# Altium project zhernakov_pwron_circuit.PrjPcb
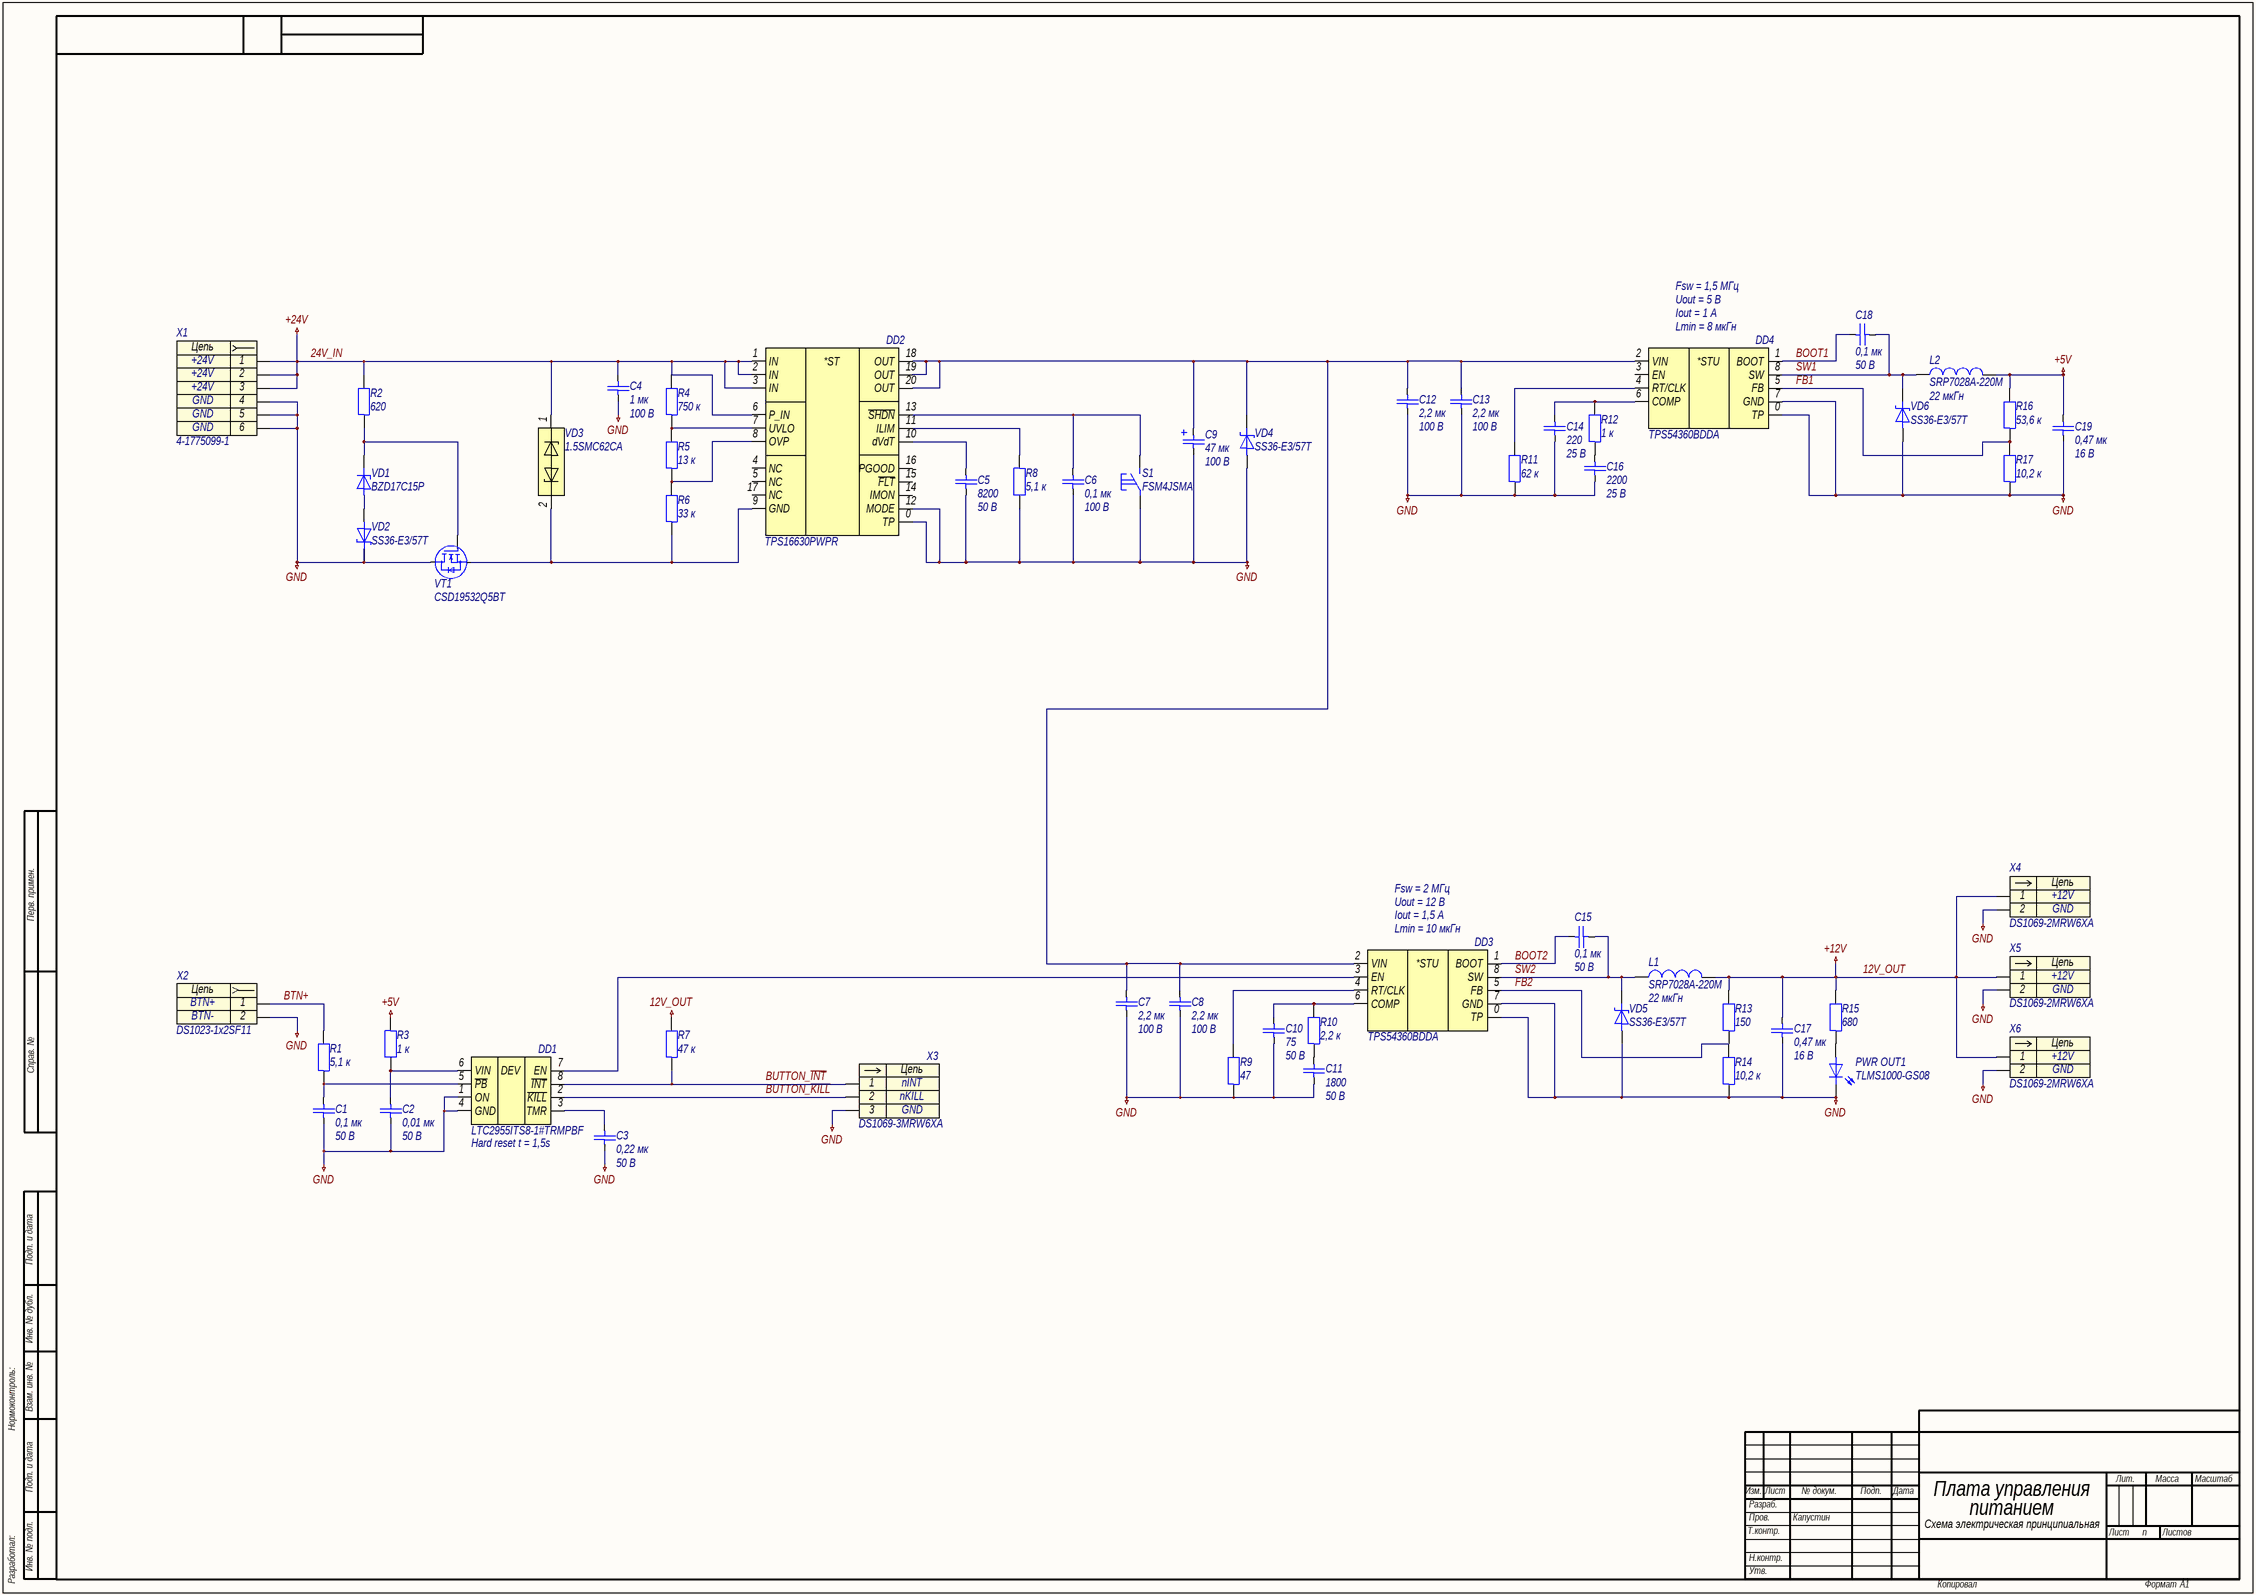
[diagram p0: zhernakov_pwron_circuit.SchDoc]
approver: Капустин; check: Капустин; designation: СПБПУ.3331506.005; developer: Жернаков; document_code: Ý3; document_type: Схема электрическая принципиальная; pcb_dec_number: СПБПУ.3331506.005; project: Плата управления питанием; sheets_total: M; title: Плата управления питанием; title_line_1: Плата управления; title_line_2: питанием
1 sheet, 57 parts. Net scope: global (net labels, ports and power ports of the same name join across sheets).
Board file: zhernakov_pwron_circuit.PcbDoc

## Sheet zhernakov_pwron_circuit.SchDoc: Плата управления питанием
size 840 x 594 mm; ApprovedBy: Капустин; CheckedBy: Капустин; DrawnBy: Жернаков; DocumentNumber: СПБПУ.3331506.005Ý3; SheetNumber: n; SheetTotal: M; DocumentCode: Ý3; ImagePath: СПБПУ.3331506.005

### Parts
C1  0,1 мк  Напряжение: 50 В  [C0603]
C2  0,01 мк  Напряжение: 50 В  [C0603]
C3  0,22 мк  Напряжение: 50 В  [C0603]
C4  1 мк  Напряжение: 100 В  [C1206]
C5  8200  Напряжение: 50 В  [C0402]
C6  0,1 мк  Напряжение: 100 В  [C0603]
C7  2,2 мк  Напряжение: 100 В  [C1206]
C8  2,2 мк  Напряжение: 100 В  [C1206]
C9  47 мк  Напряжение: 100 В  [CAPAE-1000X1000X1200]
C10  75  Напряжение: 50 В  [C0402]
C11  1800  Напряжение: 50 В  [C0402]
C12  2,2 мк  Напряжение: 100 В  [C1206]
C13  2,2 мк  Напряжение: 100 В  [C1206]
C14  220  Напряжение: 25 В  [C0603]
C15  0,1 мк  Напряжение: 50 В  [C0603]
C16  2200  Напряжение: 25 В  [C0201]
C17  0,47 мк  Напряжение: 16 В  [C0603]
C18  0,1 мк  Напряжение: 50 В  [C0603]
C19  0,47 мк  Напряжение: 16 В  [C0603]
DD1  LTC2955ITS8-1#TRMPBF  [SOT-23-8-P65-290X280X100]
DD2  TPS16630PWPR  [HTSSOP-20-P65-650X440X120-L63X25-T296X296]
DD3  TPS54360BDDA  [HSOIC-8-P127-490X390X170-L84X41-T310X240]
DD4  TPS54360BDDA  [HSOIC-8-P127-490X390X170-L84X41-T310X240]
L1  SRP7028A-220M  Индуктивность: 22 мкГн  [SRP-2-730X660X280]
L2  SRP7028A-220M  Индуктивность: 22 мкГн  [SRP-2-730X660X280]
PWR_OUT1  TLMS1000-GS08  [HL0603]
R1  5,1 к  [R0603]
R2  620  [R0603]
R3  1 к  [R0603]
R4  750 к  [R0603]
R5  13 к  [R0603]
R6  33 к  [R0603]
R7  47 к  [R0603]
R8  5,1 к  [R0603]
R9  47  [R0603]
R10  2,2 к  [R0603]
R11  62 к  [R0603]
R12  1 к  [R0603]
R13  150  [R0603]
R14  10,2 к  [R0603]
R15  680  [R0603]
R16  53,6 к  [R0603]
R17  10,2 к  [R0603]
S1  FSM4JSMA  [FSM4JSMA]
VD1  BZD17C15P  [DO-219AB-280X180X108]
VD2  SS36-E3/57T  [DO-214AB-790X590X262]
VD3  1.5SMC62CA  [DO-214AB-790X590X262]
VD4  SS36-E3/57T  [DO-214AB-790X590X262]
VD5  SS36-E3/57T  [DO-214AB-790X590X262]
VD6  SS36-E3/57T  [DO-214AB-790X590X262]
VT1  CSD19532Q5BT  [VSONP-8-P127-600X500X105]
X1  4-1775099-1  [4-1775099-1]
X2  DS1023-1x2SF11  [DS1023-1X2SF11]
X3  DS1069-3MRW6XA  [DS1069-3MRW6XA]
X4  DS1069-2MRW6XA  [DS1069-2MRW6XA]
X5  DS1069-2MRW6XA  [DS1069-2MRW6XA]
X6  DS1069-2MRW6XA  [DS1069-2MRW6XA]

### Nets
12V_OUT: C17.1 L1.2 R7.2 R13.2 R15.2 X4.1 X5.1 X6.1  [also labelled +12V]
24V_IN: C4.1 DD2.1(IN) DD2.2(IN) DD2.3(IN) DD2.6(P_IN) R2.2 R4.2 VD3.1 X1.1 X1.2 X1.3  [also labelled +24V]
+5V: C19.1 L2.2 R3.1 R16.2
GND: C1.2 C2.2 C3.2 C4.2 C5.2 C6.2 C7.2 C8.2 C9.2 C10.2 C11.2 C12.2 C13.2 C14.2 C16.2 C17.2 C19.2 DD1.1(ON) DD1.4(GND) DD2.0(TP) DD2.12(MODE) DD3.0(TP) DD3.7(GND) DD4.0(TP) DD4.7(GND) PWR_OUT1.1 R8.2 R9.1 R11.1 R14.1 R17.1 S1.1 VD2.1 VD4.2 VD5.2 VD6.2 VT1.D X1.4 X1.5 X1.6 X2.2 X3.3 X4.2 X5.2 X6.2
BOOT1: C18.1 DD4.1(BOOT)
BOOT2: C15.1 DD3.1(BOOT)
BTN+: R1.2 X2.1
BUTTON_~{INT}: DD1.8(~{INT}) R7.1 X3.1
BUTTON_~{KILL}: DD1.2(~{KILL}) X3.2
FB1: DD4.5(FB) R16.1 R17.2
FB2: DD3.5(FB) R13.1 R14.2
SW1: C18.2 DD4.8(SW) L2.1 VD6.1
SW2: C15.2 DD3.8(SW) L1.1 VD5.1
NetC1_1: C1.1 DD1.5(~{PB}) R1.1
NetC2_1: C2.1 DD1.6(VIN) R3.2
NetC3_1: C3.1 DD1.3(TMR)
NetC5_1: C5.1 DD2.10(dVdT)
NetC6_1: C6.1 DD2.13(~{SHDN}) S1.2
NetC7_1: C7.1 C8.1 C9.1 C12.1 C13.1 DD2.18(OUT) DD2.19(OUT) DD2.20(OUT) DD3.2(VIN) DD4.2(VIN) VD4.1
NetC10_1: C10.1 DD3.6(COMP) R10.2
NetC11_1: C11.1 R10.1
NetC14_1: C14.1 DD4.6(COMP) R12.2
NetC16_1: C16.1 R12.1
NetDD1_7: DD1.7(EN) DD3.3(EN)
NetDD2_7: DD2.7(UVLO) R4.1 R5.2
NetDD2_8: DD2.8(OVP) R5.1 R6.2
NetDD2_9: DD2.9(GND) R6.1 VD3.2 VT1.S
NetDD2_11: DD2.11(ILIM) R8.1
NetDD3_4: DD3.4(RT/CLK) R9.2
NetDD4_4: DD4.4(RT/CLK) R11.2
NetPWR_OUT1_2: PWR_OUT1.2 R15.1
NetR2_1: R2.1 VD1.1 VT1.G
NetVD1_2: VD1.2 VD2.2

Not connected (* = marked no-connect by the designer): DD2 4(NC) 5(NC) 14(IMON) 15(~{FLT}) 16(PGOOD) 17(NC); DD4 3(EN)

### Notes on the sheet
- Fsw = 1,5 МГц
- Uout = 5 В
- Iout = 1 А
- (near DD4) Lmin = 8 мкГн
- Fsw = 2 МГц
- Uout = 12 В
- Iout = 1,5 А
- (near DD3) Lmin = 10 мкГн
- Hard reset t = 1,5s
- Перв. примен.
- Справ. №
- Подп. и дата
- Инв. № дубл.
- Нормоконтроль:
- Взам. инв. №
- Изм.
- Лист
- № докум.
- Подп.
- Дата
- Лит.
- Масса
- Масштаб
- Т.контр.
- Пров.
- Разраб.
- Листов
- Разработал:
- Инв. № подл.
- Н.контр.
- Утв.
- Копировал
- Формат
- А1
- (in symbol dd0007) *STU; *ST
- (in symbol dd0008) DEV
- (in symbol x0007) Цепь
- (in symbol x0032) Цепь
- (in symbol x0040) Цепь
- (in symbol x0042) Цепь

### Library data of the parts
C1 C15 C18 = c0088: =Описание; ID: c0088; Фамилия: Паньков; Описание: Конденсатор керамический чип 0603 100 нФ 50 В ±10 %; Наименование: CC0603KRX7R9BB104; Производитель: YAGEO Corp.; Отклонение: ±10 %; Рабочие температуры: от –55 °С до +125 °С; Температурный коэффициент емкости: X7R; Корпус: 0603; Номинал: 0,1 мк; Номинальное напряжение: 50 В; HelpURL: https://www.yageo.com/upload/media/product/productsearch/datasheet/mlcc/UPY-GPHC_X7R_6.3V-to-50V_20.pdf
C2 = c0058: =Описание; ID: c0058; Фамилия: Паньков; Описание: Конденсатор керамический чип 0603 10 нФ 50 В ±10 %; Наименование: CC0603KRX7R9BB103; Производитель: YAGEO Corp.; Отклонение: ±10 %; Рабочие температуры: от –55 °С до +125 °С; Температурный коэффициент емкости: X7R; Корпус: 0603; Номинал: 0,01 мк; Номинальное напряжение: 50 В; HelpURL: https://www.yageo.com/upload/media/product/productsearch/datasheet/mlcc/UPY-GPHC_X7R_6.3V-to-50V_20.pdf
C3 = c0098: =Описание; ID: c0098; Фамилия: Паньков; Описание: Конденсатор керамический чип 0603 220 нФ 50 В ±10 %; Наименование: CC0603KRX5R9BB224; Производитель: YAGEO Corp.; Отклонение: ±10 %; Рабочие температуры: от –55 °С до +85 °С; Температурный коэффициент емкости: X5R; Корпус: 0603; Номинал: 0,22 мк; Номинальное напряжение: 50 В; HelpURL: https://www.yageo.com/upload/media/product/productsearch/datasheet/mlcc/UPY-GPHC_X5R_4V-to-50V_26.pdf
C4 = c0120: =Описание; ID: c0120; Фамилия: Ларионов; Описание: Конденсатор керамический чип 1206 1 мкФ 100 В ±10 %; Наименование: CC1206KKX7R0BB105; Производитель: YAGEO Corp.; Отклонение: ±10 %; Рабочие температуры: от –55 °С до +125 °С; Температурный коэффициент емкости: X7R; Корпус: 1206; Номинал: 1 мк; Номинальное напряжение: 100 В; HelpURL: https://www.yageo.com/upload/media/product/productsearch/datasheet/mlcc/UPY-NP0X7R_MV_100-to-630V_22.pdf
C5 = c0009: =Описание; ID: c0009; Фамилия: Жернаков; Описание: Конденсатор керамический чип 0402 8,2 нФ 50 В ±10 %; Наименование: CL05B822KB5NNNC; Производитель: Samsung Electro-Mechanics; Отклонение: ±10 %; Рабочие температуры: от –55 °С до +125 °С; Температурный коэффициент емкости: X7R; Корпус: 0402; Номинал: 8200; Номинальное напряжение: 50 В; HelpURL: http://product.samsungsem.com/mlcc/CL05B822KB5NNN.do
C6 = c0089: =Описание; ID: c0089; Фамилия: Ларионов; Описание: Конденсатор керамический чип 0603 100 нФ 100 В ±10 %; Наименование: CC0603KRX7R0BB104; Производитель: YAGEO Corp.; Отклонение: ±10 %; Рабочие температуры: от –55 °С до +125 °С; Температурный коэффициент емкости: X7R; Корпус: 0603; Номинал: 0,1 мк; Номинальное напряжение: 100 В; HelpURL: https://www.yageo.com/upload/media/product/productsearch/datasheet/mlcc/UPY-NP0X7R_MV_100-to-630V_22.pdf
C7 C8 C12 C13 = c0131: =Описание; ID: c0131; Фамилия: Ларионов; Описание: Конденсатор керамический чип 1206 2,2 мкФ 100 В ±10 %; Наименование: CC1206KKX7R0BB225; Производитель: YAGEO Corp.; Отклонение: ±10 %; Рабочие температуры: от –55 °С до +125 °С; Температурный коэффициент емкости: X7R; Корпус: 1206; Номинал: 2,2 мк; Номинальное напряжение: 100 В; HelpURL: https://www.yageo.com/upload/media/product/productsearch/datasheet/mlcc/UPY-NP0X7R_MV_100-to-630V_22.pdf
C9 = c0165: =Описание; ID: c0165; Фамилия: Ларионов; Описание: Конденсатор электролитический алюминиевый 47 мкФ 100 В ±20 %; Наименование: MAL214699904E3; Производитель: Vishay Intertechnology, Inc.; Отклонение: ±20 %; Эквивалентное последовательное сопротивление: 4,1 Ом; Среднеквадратичный размах пульсации тока: 0,23 А; Рабочие температуры: от –55 °С до +125 °С; Корпус: CAPAE (10 x 10 x 12); Номинал: 47 мк; Номинальное напряжение: 100 В; HelpURL: https://www.vishay.com/capacitors/list/product-28403/
C10 = c0004: =Описание; ID: c0004; Фамилия: Жернаков; Описание: Конденсатор керамический чип 0402 75 пФ 50 В ±5 %; Наименование: CL05C750JB5NNNC; Производитель: Samsung Electro-Mechanics; Отклонение: ±5 %; Рабочие температуры: от –55 °С до +125 °С; Температурный коэффициент емкости: C0G; Корпус: 0402; Номинал: 75; Номинальное напряжение: 50 В; HelpURL: http://product.samsungsem.com/mlcc/CL05C750JB5NNN.do
C11 = c0007: =Описание; ID: c0007; Фамилия: Жернаков; Описание: Конденсатор керамический чип 0201 1,8 нФ 50 В ±10 %; Наименование: CL05B182KB5NNWC; Производитель: Samsung Electro-Mechanics; Отклонение: ±10 %; Рабочие температуры: от –55 °С до +125 °С; Температурный коэффициент емкости: X7R; Корпус: 0402; Номинал: 1800; Номинальное напряжение: 50 В; HelpURL: http://product.samsungsem.com/mlcc/CL05B182KB5NNW.do
C14 = c0029: =Описание; ID: c0029; Фамилия: Паньков; Описание: Конденсатор керамический чип 0603 220 пФ 25 В ±1 %; Наименование: CC0603FRNPO8BN221; Производитель: YAGEO Corp.; Отклонение: ±1 %; Рабочие температуры: от –55 °С до +125 °С; Температурный коэффициент емкости: C0G; Корпус: 0603; Номинал: 220; Номинальное напряжение: 25 В; HelpURL: https://www.yageo.com/upload/media/product/productsearch/datasheet/mlcc/UPY-GP_NP0_16V-to-50V_18.pdf
C16 = c0044: =Описание; ID: c0044; Фамилия: Паньков; Описание: Конденсатор керамический чип 0201 2,2 нФ 25 В ±10 %; Наименование: CC0201KRX5R8BB222; Производитель: YAGEO Corp.; Отклонение: ±10 %; Рабочие температуры: от –55 °С до +85 °С; Температурный коэффициент емкости: X5R; Корпус: 0201; Номинал: 2200; Номинальное напряжение: 25 В; HelpURL: https://www.yageo.com/upload/media/product/productsearch/datasheet/mlcc/UPY-GPHC_X5R_4V-to-50V_26.pdf
C17 C19 = c0104: =Описание; ID: c0104; Фамилия: Паньков; Описание: Конденсатор керамический чип 0603 470 нФ 16 В ±10 %; Наименование: CC0603KRX5R7BB474; Производитель: YAGEO Corp.; Отклонение: ±10 %; Рабочие температуры: от –55 °С до +85 °С; Температурный коэффициент емкости: X5R; Корпус: 0603; Номинал: 0,47 мк; Номинальное напряжение: 16 В; HelpURL: https://www.yageo.com/upload/media/product/productsearch/datasheet/mlcc/UPY-GPHC_X5R_4V-to-50V_26.pdf
DD1 = dd0008: =Описание; ID: dd0008; Фамилия: Жернаков; Описание: Контроллер включения/выключения; Производитель: Analog Devices, Inc.; Напряжение: от 1,5 В до 36 В; Максимальное напряжение: 36 В; Ток: —; Рабочие температуры: от –40 °С до +85 °С; Корпус: SOT-23-8; Наименование: LTC2955ITS8-1#TRMPBF; HelpURL: https://www.analog.com/en/products/ltc2955.html
DD2 = dd0007: =Описание; ID: dd0007; Фамилия: Жернаков; Описание: Защитная микросхема eFuse 60 В и 6 А; Производитель: Texas Instruments Inc.; Напряжение: от 4,5 В до 60 В; Максимальное напряжение: 67 В; Ток: от 0,6 А до 6 А; Рабочие температуры: от –40 °С до +125 °С; Корпус: HTSSOP-20; Наименование: TPS16630PWPR; HelpURL: https://www.ti.com/product/TPS1663
DD3 DD4 = dd0007: =Описание; ID: dd0007; Фамилия: Жернаков; Описание: Понижающий преобразователь напряжения 4,5…60 В / 1…58,8 В и 3,5 А; Производитель: Texas Instruments Inc.; Входное напряжение: от 4,5 В до 60 В; Выходное напряжение: от 1,0 В до 58,8 В; Коммутируемый ток: до 3,5 А; Частота переключения: от 100 кГц до 2,5 МГц; Рабочие температуры: от –40 °С до +150 °С; Корпус: HSOIC-8; Наименование: TPS54360BDDA; HelpURL: https://www.ti.com/product/TPS54360B
L1 L2 = l0013: =Описание; ID: l0013; Фамилия: Ларионов; Описание: Катушка индуктивности 22 мкГн ±20 %; Производитель: Bourns, Inc.; Отклонение: ±20 %; Номинальное активное сопротивление: 165 мОм; Максимальное активное сопротивление: 190 мОм; Резонансная частота: 10 МГц; Номинальный ток (при нагреве на 20 °С/40 °С): 2 А; Ток насыщения: 3,5 А; Рабочее напряжение: не указано; Рабочие температуры: от –55 °С до +150 °С; Корпус: 7,3 x 6,6 x 2,8; Наименование: SRP7028A-220M; Номинал: 22 мкГн; HelpURL: https://www.bourns.com/products/magnetic-products/power-inductors-aec-q200-compliant/product/SRP7028A
PWR_OUT1 = hl0001: =Описание; ID: hl0001; Фамилия: Ларионов; Описание: Светодиод чип 0603 красный; Производитель: Vishay Intertechnology, Inc.; Цвет: Red; Номинальная сила света: 4 мкд; Номинальная длина волны: 628 нм; Номинальный прямой ток: 15 мА; Номинальное падение напряжения: 1,8 В; Рассеиваемая мощность: 40 мВт; Рабочие температуры: от -40 °С до +100 °С; Корпус: 0603; Наименование: TLMS1000-GS08; HelpURL: https://www.vishay.com/leds/list/product-83172/
R1 = r0096: =Описание; ID: r0096; Фамилия: Жернаков; Описание: Резистор чип 0603 5,1 кОм ±1 % 0,1 Вт; Наименование: RC0603FR-075K1L; Производитель: YAGEO Corp.; Отклонение: ±1 %; Номинальное напряжение: 75 В; Номинальный ток: 1 А; Рабочие температуры: от –55 °С до +155 °С; Корпус: 0603; Примечание: Ряд E24; Номинал: 5,1 к; HelpURL: https://www.yageo.com/upload/media/product/productsearch/datasheet/rchip/PYu-RC_Group_51_RoHS_L_11.pdf
R2 = r0071: =Описание; ID: r0071; Фамилия: Паньков; Описание: Резистор чип 0603 620 Ом ±1 % 0,1 Вт; Наименование: RC0603FR-07620RL; Производитель: YAGEO Corp.; Отклонение: ±1 %; Номинальное напряжение: 75 В; Номинальный ток: 1 А; Рабочие температуры: от –55 °С до +155 °С; Корпус: 0603; Примечание: Ряд E24; Номинал: 620; HelpURL: https://www.yageo.com/upload/media/product/productsearch/datasheet/rchip/PYu-RC_Group_51_RoHS_L_11.pdf
R3 R12 = r0076: =Описание; ID: r0076; Фамилия: Ларионов; Описание: Резистор чип 0603 1 кОм ±1 % 0,1 Вт; Наименование: RC0603FR-071KL; Производитель: YAGEO Corp.; Отклонение: ±1 %; Номинальное напряжение: 75 В; Номинальный ток: 1 А; Рабочие температуры: от –55 °С до +155 °С; Корпус: 0603; Примечание: Ряд E24; Номинал: 1 к; HelpURL: https://www.yageo.com/upload/media/product/productsearch/datasheet/rchip/PYu-RC_Group_51_RoHS_L_11.pdf
R4 = r0170: =Описание; ID: r0170; Фамилия: Паньков; Описание: Резистор чип 0603 750 кОм ±1 % 0,1 Вт; Наименование: RC0603FR-07750KL; Производитель: YAGEO Corp.; Отклонение: ±1 %; Номинальное напряжение: 75 В; Номинальный ток: 1 А; Рабочие температуры: от –55 °С до +155 °С; Корпус: 0603; Примечание: Ряд E24; Номинал: 750 к; HelpURL: https://www.yageo.com/upload/media/product/productsearch/datasheet/rchip/PYu-RC_Group_51_RoHS_L_11.pdf
R5 = r0110: =Описание; ID: r0110; Фамилия: Жернаков; Описание: Резистор чип 0603 13 кОм ±1 % 0,1 Вт; Наименование: RC0603FR-0713KL; Производитель: YAGEO Corp.; Отклонение: ±1 %; Номинальное напряжение: 75 В; Номинальный ток: 1 А; Рабочие температуры: от –55 °С до +155 °С; Корпус: 0603; Примечание: Ряд E24; Номинал: 13 к; HelpURL: https://www.yageo.com/upload/media/product/productsearch/datasheet/rchip/PYu-RC_Group_51_RoHS_L_11.pdf
R6 = r0123: =Описание; ID: r0123; Фамилия: Паньков; Описание: Резистор чип 0603 33 кОм ±1 % 0,1 Вт; Наименование: RC0603FR-0733KL; Производитель: YAGEO Corp.; Отклонение: ±1 %; Номинальное напряжение: 75 В; Номинальный ток: 1 А; Рабочие температуры: от –55 °С до +155 °С; Корпус: 0603; Примечание: Ряд E24; Номинал: 33 к; HelpURL: https://www.yageo.com/upload/media/product/productsearch/datasheet/rchip/PYu-RC_Group_51_RoHS_L_11.pdf
R7 = r0129: =Описание; ID: r0129; Фамилия: Паньков; Описание: Резистор чип 0603 47 кОм ±1 % 0,1 Вт; Наименование: RC0603FR-0747KL; Производитель: YAGEO Corp.; Отклонение: ±1 %; Номинальное напряжение: 75 В; Номинальный ток: 1 А; Рабочие температуры: от –55 °С до +155 °С; Корпус: 0603; Примечание: Ряд E24; Номинал: 47 к; HelpURL: https://www.yageo.com/upload/media/product/productsearch/datasheet/rchip/PYu-RC_Group_51_RoHS_L_11.pdf
R8 = r0019: =Описание; ID: r0019; Фамилия: Жернаков; Описание: Резистор чип 0603 5,1 кОм ±1 % 0,1 Вт; Наименование: RC0603FR-075K1L; Производитель: YAGEO Corp.; Отклонение: ±1 %; Номинальное напряжение: 75 В; Рабочие температуры: от -55 °С до +155 °С; Номинальный ток: 1 А; Корпус: 0603; Номинал: 5,1 к; HelpURL: https://www.yageo.com/upload/media/product/productsearch/datasheet/rchip/PYu-RC_Group_51_RoHS_L_11.pdf
R9 = r0043: =Описание; ID: r0043; Фамилия: Паньков; Описание: Резистор чип 0603 47 Ом ±1 % 0,1 Вт; Наименование: RC0603FR-0747RL; Производитель: YAGEO Corp.; Отклонение: ±1 %; Номинальное напряжение: 75 В; Номинальный ток: 1 А; Рабочие температуры: от –55 °С до +155 °С; Корпус: 0603; Примечание: Ряд E24; Номинал: 47; HelpURL: https://www.yageo.com/upload/media/product/productsearch/datasheet/rchip/PYu-RC_Group_51_RoHS_L_11.pdf
R10 = r0085: =Описание; ID: r0085; Фамилия: Паньков; Описание: Резистор чип 0603 2,2 кОм ±1 % 0,1 Вт; Наименование: RC0603FR-072K2L; Производитель: YAGEO Corp.; Отклонение: ±1 %; Номинальное напряжение: 75 В; Номинальный ток: 1 А; Рабочие температуры: от –55 °С до +155 °С; Корпус: 0603; Примечание: Ряд E24; Номинал: 2,2 к; HelpURL: https://www.yageo.com/upload/media/product/productsearch/datasheet/rchip/PYu-RC_Group_51_RoHS_L_11.pdf
R11 = r0135: =Описание; ID: r0135; Фамилия: Паньков; Описание: Резистор чип 0603 62 кОм ±1 % 0,1 Вт; Наименование: RC0603FR-0762KL; Производитель: YAGEO Corp.; Отклонение: ±1 %; Номинальное напряжение: 75 В; Номинальный ток: 1 А; Рабочие температуры: от –55 °С до +155 °С; Корпус: 0603; Примечание: Ряд E24; Номинал: 62 к; HelpURL: https://www.yageo.com/upload/media/product/productsearch/datasheet/rchip/PYu-RC_Group_51_RoHS_L_11.pdf
R13 = r0056: =Описание; ID: r0056; Фамилия: Паньков; Описание: Резистор чип 0603 150 Ом ±1 % 0,1 Вт; Наименование: RC0603FR-07150RL; Производитель: YAGEO Corp.; Отклонение: ±1 %; Номинальное напряжение: 75 В; Номинальный ток: 1 А; Рабочие температуры: от –55 °С до +155 °С; Корпус: 0603; Примечание: Ряд E24; Номинал: 150; HelpURL: https://www.yageo.com/upload/media/product/productsearch/datasheet/rchip/PYu-RC_Group_51_RoHS_L_11.pdf
R14 R17 = r0014: =Описание; ID: r0014; Фамилия: Жернаков; Описание: Резистор чип 0603 10,2 кОм ±1 % 0,1 Вт; Наименование: RC0603FR-0710K2L; Производитель: YAGEO Corp.; Отклонение: ±1 %; Номинальное напряжение: 75 В; Рабочие температуры: от -55 °С до +155 °С; Номинальный ток: 1 А; Корпус: 0603; Номинал: 10,2 к; HelpURL: https://www.yageo.com/upload/media/product/productsearch/datasheet/rchip/PYu-RC_Group_51_RoHS_L_11.pdf
R15 = r0072: =Описание; ID: r0072; Фамилия: Паньков; Описание: Резистор чип 0603 680 Ом ±1 % 0,1 Вт; Наименование: RC0603FR-07680RL; Производитель: YAGEO Corp.; Отклонение: ±1 %; Номинальное напряжение: 75 В; Номинальный ток: 1 А; Рабочие температуры: от –55 °С до +155 °С; Корпус: 0603; Примечание: Ряд E24; Номинал: 680; HelpURL: https://www.yageo.com/upload/media/product/productsearch/datasheet/rchip/PYu-RC_Group_51_RoHS_L_11.pdf
R16 = r0017: =Описание; ID: r0017; Фамилия: Жернаков; Описание: Резистор чип 0603 53,6 кОм ±0,1 % 0,1 Вт; Наименование: RC0603BR-0753K6L; Производитель: YAGEO Corp.; Отклонение: ±0,1 %; Номинальное напряжение: 75 В; Рабочие температуры: от -55 °С до +155 °С; Номинальный ток: 1 А; Корпус: 0603; Номинал: 53,6 к; HelpURL: https://www.yageo.com/upload/media/product/productsearch/datasheet/rchip/PYu-RC_Group_51_RoHS_L_11.pdf
S1 = s0001: =Описание; ID: s0001; Фамилия: Паньков; Описание: Тактовая кнопка поверхностного монтажа; Производитель: TE Connectivity; Ток нагрузки: 50 мА @ 24 В; Сопротивление контакта: 100 мОм; Количество контактов: 4; Рабочие температуры: от –35 °С до +85 °С; Промывка: Запрещена; Корпус: 6,00 x 6,00 x 4,98; Наименование: FSM4JSMA; HelpURL: https://www.te.com/usa-en/product-4-1437565-1.html
VD1 = vd0016: =Описание; ID: vd0016; Фамилия: Жернаков; Описание: Стабилитрон 15 В; Производитель: Vishay Intertechnology, Inc.; Номинальное напряжение стабилизации: 15 В; Разброс напряжения стабилизации: 13,8...15,6 В; Номинальный ток стабилизации: 50 мА; Рабочие температуры: от –55 °С до +150 °С; Корпус: DO-219AB; Наименование: BZD17C15P; HelpURL: https://www.vishay.com/product?docid=85161
VD2 VD4-VD6 = vd0005: =Описание; ID: vd0005; Фамилия: Жернаков; Описание: Диод Шоттки 60 В 3 А; Производитель: Vishay Intertechnology, Inc.; Максимальное прямое напряжение: 0,75 В; Максимальное обратное напряжение: 60 В; Максимальный прямой ток: 3 А; Рабочие температуры: от –55 °С до +150 °С; Корпус: DO-214AB; Наименование: SS36-E3/57T; HelpURL: https://www.vishay.com/product?docid=88751
VD3 = vd0009: =Описание; ID: vd0009; Фамилия: Ларионов; Описание: Двунаправленная диодная сборка для подавления помех 53 В; Производитель: Littelfuse, Inc.; Корпус: DO-214AB; Наименование: 1.5SMC62CA; HelpURL: https://www.littelfuse.com/products/tvs-diodes/surface-mount/1_5smc.aspx
VT1 = vt0005: =Описание; ID: vt0005; Фамилия: Жернаков; Описание: Полевой N-канальный МДП-транзистор 100 В 17 А; Производитель: Texas Instruments Inc.; Напряжение затвор — исток: ±20 В; Напряжение сток — исток: 100 В; Ток стока: 17 А; Сопротивление сток — исток: 5,7 мОм; Рабочие температуры: от –55 °С до +150 °С; Корпус: SON-8; Наименование: CSD19532Q5BT; HelpURL: https://www.ti.com/product/CSD19532Q5B
X1 = x0007: =Описание; Contact_1: +24V; Contact_4: GND; ID: x0007; Фамилия: Жернаков; Описание: ATX Power 6 pin гнездо прямой; Производитель: TE Connectivity; Contact_2: +24V; Contact_3: +24V; Contact_5: GND; Contact_6: GND; Наименование: 4-1775099-1; HelpURL: https://www.te.com/usa-en/product-4-1775099-1.html
X2 = x0032: =Описание; Contact_1: BTN+; Contact_2: BTN-; ID: x0032; Фамилия: Паньков; Описание: PBS 2 pin 2,54 мм гнездо прямой; Производитель: Connfly Electronic Co., Ltd.; Наименование: DS1023-1x2SF11; HelpURL: http://en.connfly.group/product/xVkr=EusQssAN0gN=Aos=mU+UrVkR9kqEAN0gN0AUCUNB+A
X3 = x0042: =Описание; Contact_1: nINT; Contact_2: nKILL; Contact_3: GND; ID: x0042; Фамилия: Паньков; Описание: CWF 3 pin Type A 2,5 мм вилка угловой; Производитель: Connfly Electronic Co., Ltd.; Наименование: DS1069-3MRW6XA; HelpURL: http://en.connfly.group/product/xVkr=EusQssAN0gN=Aos=mU+UrVkR9kqEAN0gN0MUR+g+NB+A
X4-X6 = x0040: =Описание; Contact_1: +12V; Contact_2: GND; ID: x0040; Фамилия: Паньков; Описание: CWF 2 pin Type A 2,5 мм вилка угловой; Производитель: Connfly Electronic Co., Ltd.; Наименование: DS1069-2MRW6XA; HelpURL: http://en.connfly.group/product/xVkr=EusQssAN0gN=Aos=mU+UrVkR9kqEAN0gN0MUR+g+NB+A